# EAGLE design Terminada_v2.1 (EAGLE 6.1)
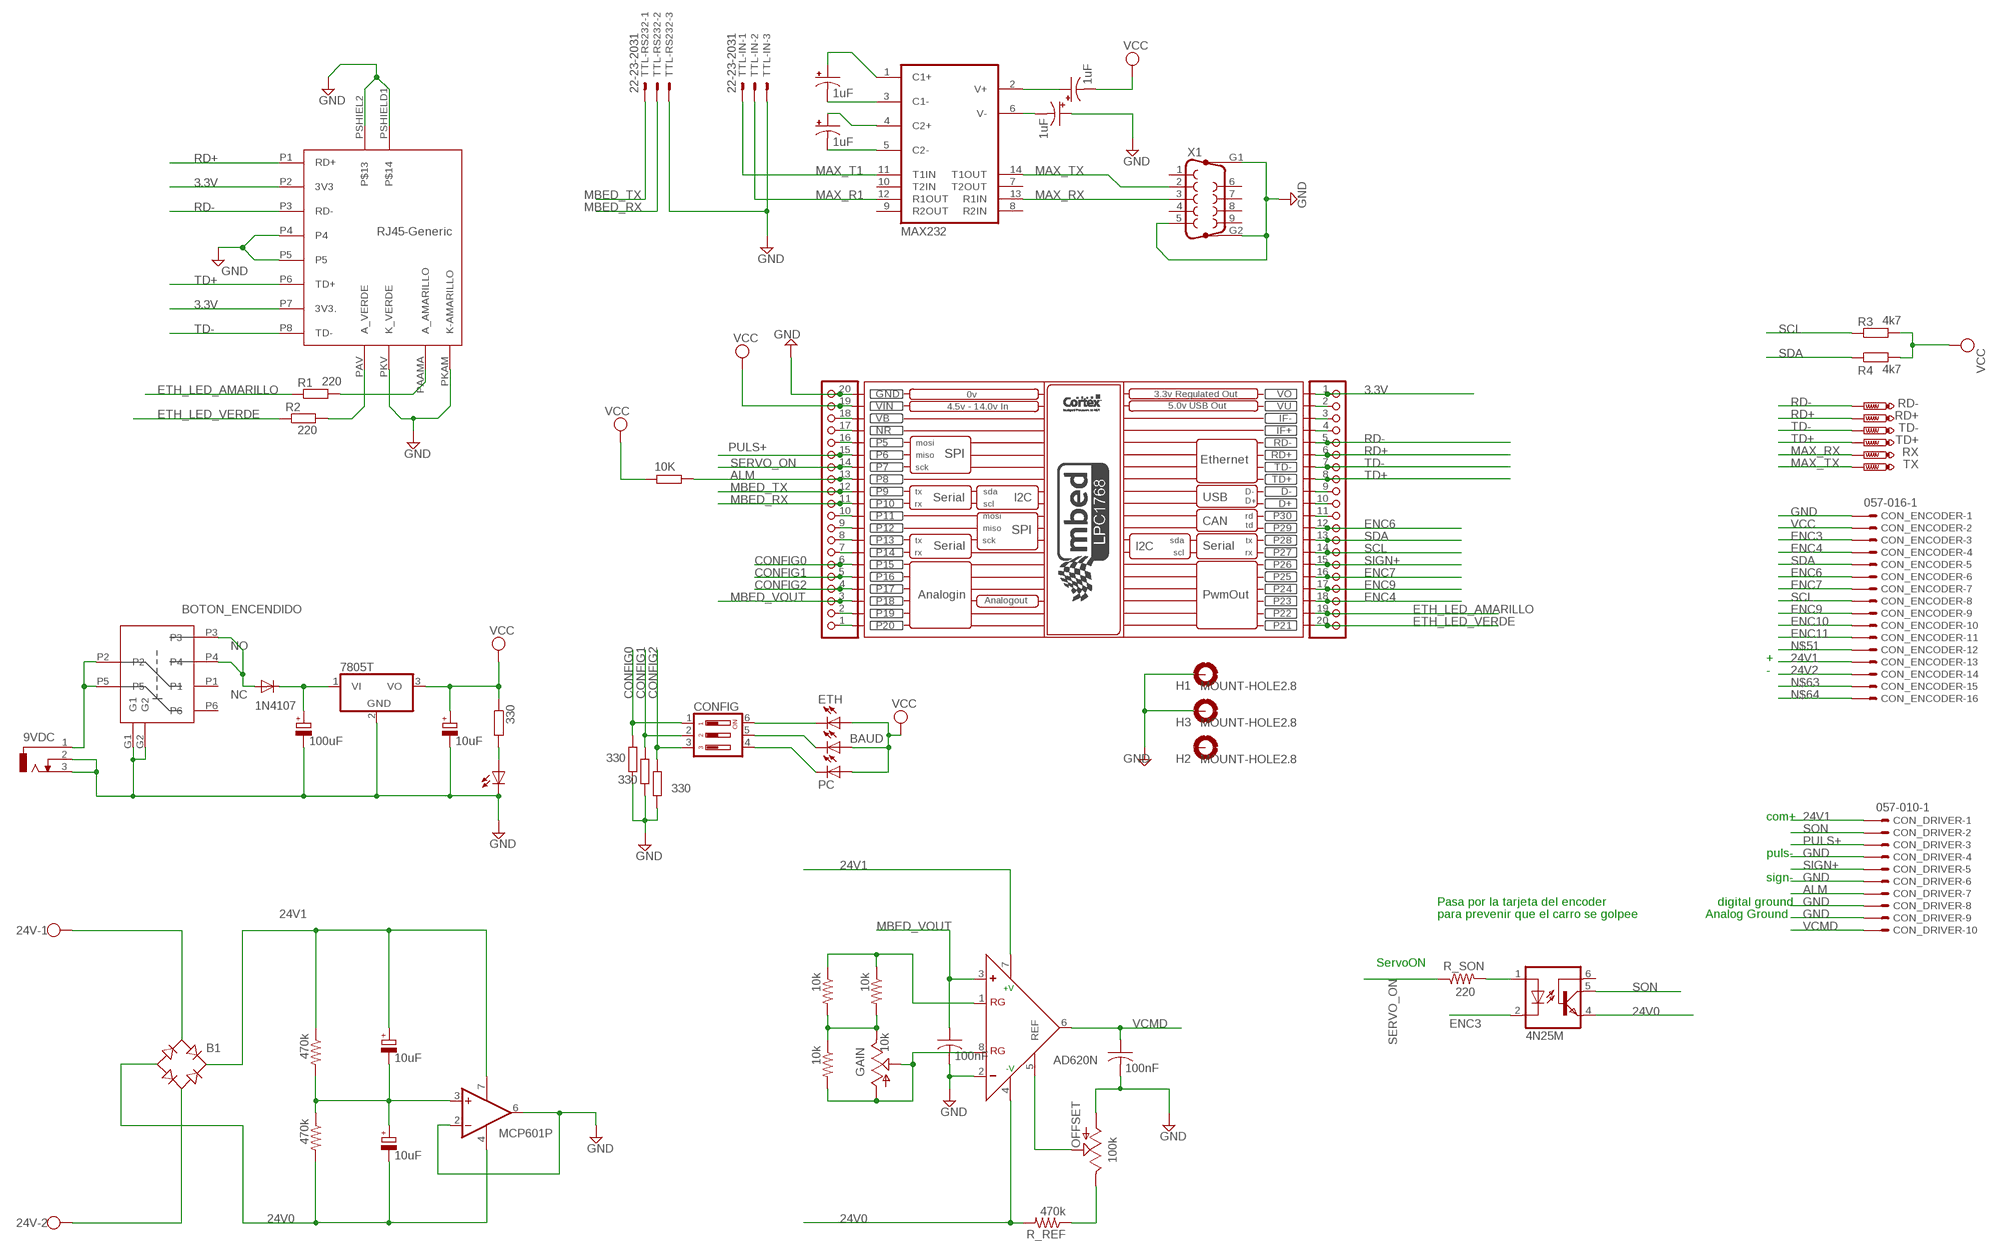
[diagram p0: schematic, sheet 1]

## Parts
9VDC  DCJ0303  [DCJ0303]
24V  W237-02P  [W237-132]
B1  RB1A  [RB1A]
BAUD  LED3MM  [LED3MM]
C1_9V  100uF  CPOL-EUTT5D7  [TT5D7]
C1_+24  10uF  CPOL-EUTT5D7  [TT5D7]
C1_MAX  1uF  CPOL-USE2,5-6E  [E2,5-6E]
C2_0V  10uF  CPOL-EUTT5D7  [TT5D7]
C2_9V  10uF  CPOL-EUTT5D7  [TT5D7]
C2_MAX  1uF  CPOL-USE2,5-6E  [E2,5-6E]
C3_AOUT  100nF  C-US025-024X044  [C025-024X044]
C3_MAX  1uF  CPOL-USE2,5-6E  [E2,5-6E]
C4_MAX  1uF  CPOL-USE2,5-6E  [E2,5-6E]
C5_AOUT  100nF  C-US025-024X044  [C025-024X044]
CON_DRIVER  057-010-1  [057-010-1]
CON_ENCODER  057-016-1  [057-016-1]
CONFIG  DIP03YL  [DIP03YL]
D1_INPUT  1N4107  1N4148DO35-10  [DO35-10]
ETH  LED3MM  [LED3MM]
GAIN  10k  TRIM_US-RJ9W  [RJ9W]
H1  MOUNT-HOLE2.8  MOUNT-PAD-ROUND3.3  [3,3-PAD]
H2  MOUNT-HOLE2.8  MOUNT-PAD-ROUND3.3  [3,3-PAD]
H3  MOUNT-HOLE2.8  MOUNT-PAD-ROUND3.3  [3,3-PAD]
IC1  MAX232  [DIL16]
IC2  7805T  [TO220H]
IC3  MCP601P  [DIL08]
IC4  AD620N  [DIL08]
JP_LEFT  PINHD-1X20  [1X20]
JP_RIGHT  PINHD-1X20  [1X20]
KIT1  MBED_NXP_LPC1768  [MBED-KIT]
OFFSET  100k  TRIM_US-RJ9W  [RJ9W]
OK1  4N25M  [DIL06]
ON/OFF  BOTON_ENCENDIDO  [BOTON_ENCNEDIDO]
PC  LED3MM  [LED3MM]
POWER  LED3MM  [LED3MM]
PWR_LED_R  330  R-EU_0204/7  [0204/7]
R1  220  R-EU_0207/15  [0207/15]
R1_DIV  470k  R-US_0207/10  [0207/10]
R1_G  10k  R-US_0204/7  [0204/7]
R2  220  R-EU_0207/15  [0207/15]
R2_DIV  470k  R-US_0207/10  [0207/10]
R2_G  10k  R-US_0204/7  [0204/7]
R3  4k7  R-EU_0204/7  [0204/7]
R3_G  10k  R-US_0204/7  [0204/7]
R4  4k7  R-EU_0204/7  [0204/7]
R13  330  R-EU_0204/7  [0204/7]
R14  330  R-EU_0204/7  [0204/7]
R15  330  R-EU_0204/7  [0204/7]
R16_ALM  10K  R-EU_0207/12  [0207/12]
R_REF  470k  R-US_0204/7  [0204/7]
R_SON  220  R-US_0207/7  [0207/7]
RD+  PTR1PAD1-13Y  [P1-13Y]
RD-  PTR1PAD1-13Y  [P1-13Y]
RX  PTR1PAD1-13Y  [P1-13Y]
TD+  PTR1PAD1-13Y  [P1-13Y]
TD-  PTR1PAD1-13Y  [P1-13Y]
TTL-IN  22-23-2031  [22-23-2031]
TTL-RS232  22-23-2031  [22-23-2031]
TX  PTR1PAD1-13Y  [P1-13Y]
U$1  RJ-45-GENERIC  [RJ45-GENERIC]
X1  F09HP  [F09HP]

## Nets
3.3V: JP_RIGHT.1 KIT1.VOUT(VO) U$1.P2(3V3) U$1.P7(3V3.)
24V0: B1.- C2_0V.- IC3.4(V-) IC4.4(-V) OK1.4(EMI) R2_DIV.2 R_REF.2
24V1: B1.+ C1_+24.+ CON_DRIVER.1 CON_ENCODER.13 IC3.7(V+) IC4.7(+V) R1_DIV.1
24V2: CON_ENCODER.14
ALM: CON_DRIVER.7 JP_LEFT.13 KIT1.P$8(P8) R16_ALM.1
CONFIG0: CONFIG.1 JP_LEFT.6 KIT1.P$15(P15) R15.2
CONFIG1: CONFIG.2 JP_LEFT.5 KIT1.P$16(P16) R14.2
CONFIG2: CONFIG.3 JP_LEFT.4 KIT1.P$17(P17) R13.2
ENC3: CON_ENCODER.3 OK1.2(C)
ENC4: CON_ENCODER.4 JP_RIGHT.18 KIT1.P$23(P23)
ENC6: CON_ENCODER.6 JP_RIGHT.12 KIT1.P$29(P29)
ENC7: CON_ENCODER.7 JP_RIGHT.16 KIT1.P$25(P25)
ENC9: CON_ENCODER.9 JP_RIGHT.17 KIT1.P$24(P24)
ENC10: CON_ENCODER.10
ENC11: CON_ENCODER.11
ETH_LED_AMARILLO: JP_RIGHT.19 KIT1.P$22(P22) R1.1
ETH_LED_VERDE: JP_RIGHT.20 KIT1.P$21(P21) R2.1
GND: 9VDC.2 9VDC.3 C1_9V.- C2_9V.- C3_AOUT.2 C3_MAX.+ C5_AOUT.2 CON_DRIVER.4 CON_DRIVER.6 CON_DRIVER.8 CON_DRIVER.9 CON_ENCODER.1 H1.B3,3(MOUNT) H3.B3,3(MOUNT) IC2.2(GND) IC3.2(-IN) IC3.6(OUT) IC4.2(-) JP_LEFT.20 KIT1.GND OFFSET.A ON/OFF.G1 ON/OFF.G2 POWER.K(C) R13.1 R14.1 R15.1 TTL-IN.3 TTL-RS232.3 U$1.P4 U$1.P5 U$1.PKAM(K-AMARILLO) U$1.PKV(K_VERDE) U$1.PSHIEL2 U$1.PSHIELD1 X1.5 X1.G1 X1.G2
MAX_R1: IC1.12(R1OUT) TTL-IN.2
MAX_RX: IC1.13(R1IN) RX.TP X1.3
MAX_T1: IC1.11(T1IN) TTL-IN.1
MAX_TX: IC1.14(T1OUT) TX.TP X1.2
MBED_RX: JP_LEFT.11 KIT1.P$10(P10) TTL-RS232.2
MBED_TX: JP_LEFT.12 KIT1.P$9(P9) TTL-RS232.1
MBED_VOUT: C5_AOUT.1 IC4.3(+) JP_LEFT.3 KIT1.P$18(P18)
N$1: 24V.1 B1.AC1
N$2: 24V.2 B1.AC2
N$3: C1_+24.- C2_0V.+ IC3.3(+IN) R1_DIV.2 R2_DIV.1
N$5: JP_RIGHT.2 KIT1.VU
N$7: JP_RIGHT.3 KIT1.IF-
N$8: OFFSET.E R_REF.1
N$9: IC4.1(RG) R1_G.1 R3_G.1
N$10: GAIN.E R1_G.2 R2_G.1 R3_G.2
N$11: GAIN.A GAIN.S IC4.8(RG) R2_G.2
N$12: D1_INPUT.A ON/OFF.P3 ON/OFF.P4
N$14: JP_RIGHT.4 KIT1.IF+
N$15: IC4.5(REF) OFFSET.S
N$16: JP_RIGHT.11 KIT1.P$30(P30)
N$18: 9VDC.1 ON/OFF.P2 ON/OFF.P5
N$20: OK1.1(A) R_SON.2
N$21: C1_9V.+ D1_INPUT.C IC2.1(VI)
N$24: CONFIG.6 ETH.K(C)
N$25: BAUD.K(C) CONFIG.5
N$26: CONFIG.4 PC.K(C)
N$31: JP_RIGHT.9 KIT1.D-
N$32: JP_RIGHT.10 KIT1.D+
N$33: C1_MAX.+ IC1.1(C1+)
N$34: C1_MAX.- IC1.3(C1-)
N$35: C2_MAX.- IC1.5(C2-)
N$36: C2_MAX.+ IC1.4(C2+)
N$37: C4_MAX.+ IC1.2(V+)
N$38: C3_MAX.- IC1.6(V-)
N$46: R1.2 U$1.PAAMA(A_AMARILLO)
N$48: JP_LEFT.18 KIT1.VB
N$49: JP_LEFT.17 KIT1.NR
N$50: JP_LEFT.16 KIT1.P$5(P5)
N$51: CON_ENCODER.12
N$52: R2.2 U$1.PAV(A_VERDE)
N$53: JP_LEFT.10 KIT1.P$11(P11)
N$54: JP_LEFT.9 KIT1.P$12(P12)
N$55: JP_LEFT.8 KIT1.P$13(P13)
N$57: JP_LEFT.7 KIT1.P$14(P14)
N$59: JP_LEFT.2 KIT1.P$19(P19)
N$60: JP_LEFT.1 KIT1.P$20(P20)
N$61: POWER.A PWR_LED_R.2
N$63: CON_ENCODER.15
N$64: CON_ENCODER.16
PULS+: CON_DRIVER.3 JP_LEFT.15 KIT1.P$6(P6)
RD+: JP_RIGHT.6 KIT1.RD+ RD+.TP U$1.P1(RD+)
RD-: JP_RIGHT.5 KIT1.RD- RD-.TP U$1.P3(RD-)
SCL: CON_ENCODER.8 JP_RIGHT.14 KIT1.P$27(P27) R3.1
SDA: CON_ENCODER.5 JP_RIGHT.13 KIT1.P$28(P28) R4.1
SERVO_ON: JP_LEFT.14 KIT1.P$7(P7) R_SON.1
SIGN+: CON_DRIVER.5 JP_RIGHT.15 KIT1.P$26(P26)
SON: CON_DRIVER.2 OK1.5(COL)
TD+: JP_RIGHT.8 KIT1.TD+ TD+.TP U$1.P6(TD+)
TD-: JP_RIGHT.7 KIT1.TD- TD-.TP U$1.P8(TD-)
VCC: BAUD.A C2_9V.+ C4_MAX.- CON_ENCODER.2 ETH.A IC2.3(VO) JP_LEFT.19 KIT1.VIN PC.A PWR_LED_R.1 R3.2 R4.2 R16_ALM.2
VCMD: C3_AOUT.1 CON_DRIVER.10 IC4.6(OUT)
Unconnected: H2.B3,3(MOUNT) IC1.7(T2OUT) IC1.8(R2IN) IC1.9(R2OUT) IC1.10(T2IN) OK1.6(BAS) ON/OFF.P1 ON/OFF.P6 X1.1 X1.4 X1.6 X1.7 X1.8 X1.9

## Notes on the sheet
- +
- -
- com+
- puls-
- sign-
- Pasa por la tarjeta del encoder | digital ground
- para prevenir que el carro se golpee | Analog Ground
- ServoON

## Power pins joined to a net without a drawn wire
GND: IC1.15(GND)
VCC: IC1.16(VCC)

## Library data of the parts
9VDC = con-jack:DCJ0303: DC POWER JACK Source: DCJ0303.pdf
24V = con-wago-508:W237-02P: WAGO SREW CLAMP
B1 = rectifier:RB1A: RECTIFIER 1 A
BAUD ETH PC POWER = led:LED: LED OSRAM: - CHIPLED LG R971, LG N971, LY N971, LG Q971, LY Q971, LO R971, LY R971 LH N974, LH R974 LS Q976, LO Q976, LY Q976 LO Q996 - Hyper CHIPLED LW Q18S LB Q993, LB Q99A, LB R99A - SideLED LS A670, LO A670, LY A670, LG A670, LP A670 LB A673, LV A673, LT A673, LW A673 LH A674 LY A675 LS A676, LA A676, LO A676, LY A676, LW A676 LS A679, LY A679, LG A679 - Hyper Micro SIDELED® LS Y876, LA Y876, LO Y876, LY Y876 LT Y87S - SmartLED LW L88C, LW L88S LB L89C, LB L89S, LG L890 LS L89K, LO L89K, LY L89K LS L896, LA L896, LO L896, LY L896 - TOPLED LS T670, LO T670, LY T670, LG T670, LP T670 LSG T670, LSP T670, LSY T670, LOP T670, LYG T670 LG T671, LOG T671, LSG T671 LB T673, LV T673, LT T673, LW T673 LH T674 LS T676, LA T676, LO T676, LY T676, LB T676, LH T676, LSB T676, LW T676 LB T67C, LV T67C, LT T67C, LS T67K, LO T67K, LY T67K, LW E67C LS E67B, LA E67B, LO E67B, LY E67B, LB E67C, LV E67C, LT E67C LW T67C LS T679, LY T679, LG T679 LS T770, LO T770, LY T770, LG T770, LP T770 LB T773, LV T773, LT T773, LW T773 LH T774 LS E675, LA E675, LY E675, LS T675 LS T776, LA T776, LO T776, LY T776, LB T776 LHGB T686 LT T68C, LB T68C - Hyper Mini TOPLED® LB M676 - Mini TOPLED Santana® LG M470 LS M47K, LO M47K, LY M47K Source: http://www.osram.convergy.de LUXEON: - LUMILED® LXK2-PW12-R00, LXK2-PW12-S00, LXK2-PW14-U00, LXK2-PW14-V00 LXK2-PM12-R00, LXK2-PM12-S00, LXK2-PM14-U00 LXK2-PE12-Q00, LXK2-PE12-R00, LXK2-PE12-S00, LXK2-PE14-T00, LXK2-PE14-U00 LXK2-PB12-K00, LXK2-PB12-L00, LXK2-PB12-M00, LXK2-PB14-N00, LXK2-PB14-P00, LXK2-PB14-Q00 LXK2-PR12-L00, LXK2-PR12-M00, LXK2-PR14-Q00, LXK2-PR14-R00 LXK2-PD12-Q00, LXK2-PD12-R00, LXK2-PD12-S00 LXK2-PH12-R00, LXK2-PH12-S00 LXK2-PL12-P00, LXK2-PL12-Q00, LXK2-PL12-R00 Source: www.luxeon.com KINGBRIGHT: KA-3528ASYC Source: www.kingbright.com
C1_9V C1_+24 C2_0V C2_9V = rcl:CPOL-EU: POLARIZED CAPACITOR, European symbol
C1_MAX C2_MAX C3_MAX C4_MAX = rcl:CPOL-US: POLARIZED CAPACITOR, American symbol
C3_AOUT C5_AOUT = rcl:C-US: CAPACITOR, American symbol
CON_DRIVER = con-panduit:057-010-: CONNECTOR 10-pin series 057 contact pc board low profile headers; OC_FARNELL: unknown; OC_NEWARK: unknown
CON_ENCODER = con-panduit:057-016-: CONNECTOR 10-pin series 057 contact pc board low profile headers; OC_FARNELL: unknown; OC_NEWARK: unknown
CONFIG = switch-dil:DIP03YL: DIL/CODE SWITCH
D1_INPUT = diode:1N4148: DIODE high speed (Philips)
GAIN OFFSET = pot:TRIM_US-: POTENTIOMETER
H1-H3 = holes:MOUNT-PAD-ROUND: MOUNTING PAD, round
IC1 = maxim:MAX232: RS232 TRANSEIVER
IC2 = linear:78*: Positive VOLTAGE REGULATOR Source: http://cache.national.com/ds/LM/LM78L05.pdf http://www.fairchildsemi.com/ds/LM/LM7805.pdf
IC3 = linear:MCP601: Single Op Amp 2.7V to 6.0V Single Supply CMOS Source: http://ww1.microchip.com/downloads/en/DeviceDoc/21314g.pdf
IC4 = analog-devices:AD620: Low Cost, Low Power, Instrumentation Amplifier Source: http://www.analog.com/UploadedFiles/Data_Sheets/37793330023930AD620_e.pdf
JP_LEFT JP_RIGHT = pinhead:PINHD-1X20: PIN HEADER
KIT1 = MBED_v2.1:MBED_NXP_LPC1768: Mbed LPC1768 - ARM CORTEX v2.1 * Schematic symbol is now placed in eagles's default raster. *The pads diameter are suitable for routing between mbed pins * mbed pads are 0.8 mm drill diameter. --------------------------------------------- Created by: Mohamed Yousry *Alexandria, Egypt *Email: mohamed.yousry@ieeegoldegypt.org
OK1 = optocoupler:4N*?M: General Purpose 6-Pin Phototransistor Optocouplers Source: http://www.fairchildsemi.com/ds/4N/4N35-M.pdf
ON/OFF = Boton_Encendido:BOTON_ENCENDIDO
PWR_LED_R R1-R4 R13-R15 R16_ALM = rcl:R-EU_: RESISTOR, European symbol
R1_DIV R1_G R2_DIV R2_G R3_G R_REF = resistor:R-US_: RESISTOR, American symbol
R_SON = rcl:R-US_: RESISTOR, American symbol
RD+ RD- RX TD+ TD- TX = testpad:PTR1: TEST PIN
TTL-IN TTL-RS232 = con-molex:22-23-2031: .100" (2.54mm) Center Header - 3 Pin; MF: MOLEX; MPN: 22-23-2031; OC_FARNELL: 1462950; OC_NEWARK: 30C0862
U$1 = RJ45:RJ-45-GENERIC
X1 = con-subd:F09HP: SUB-D

## Board
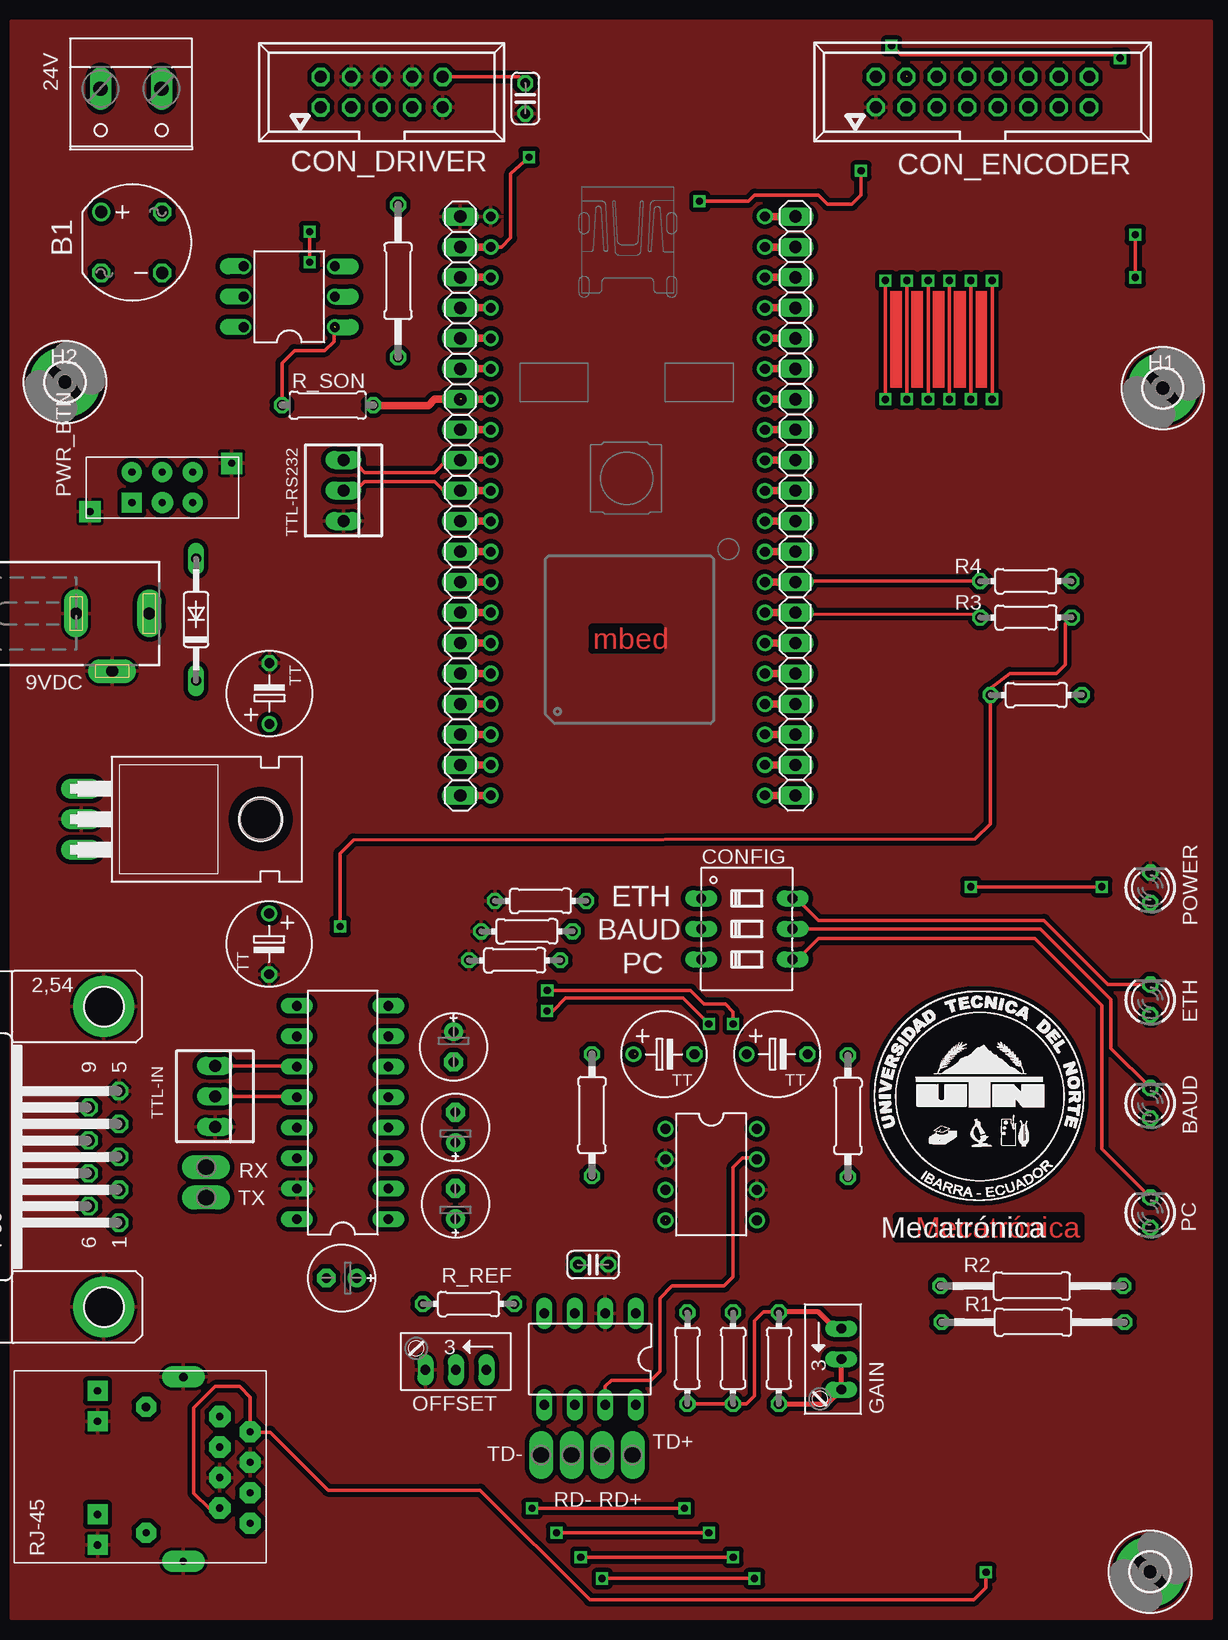
[diagram p1: board, top side]
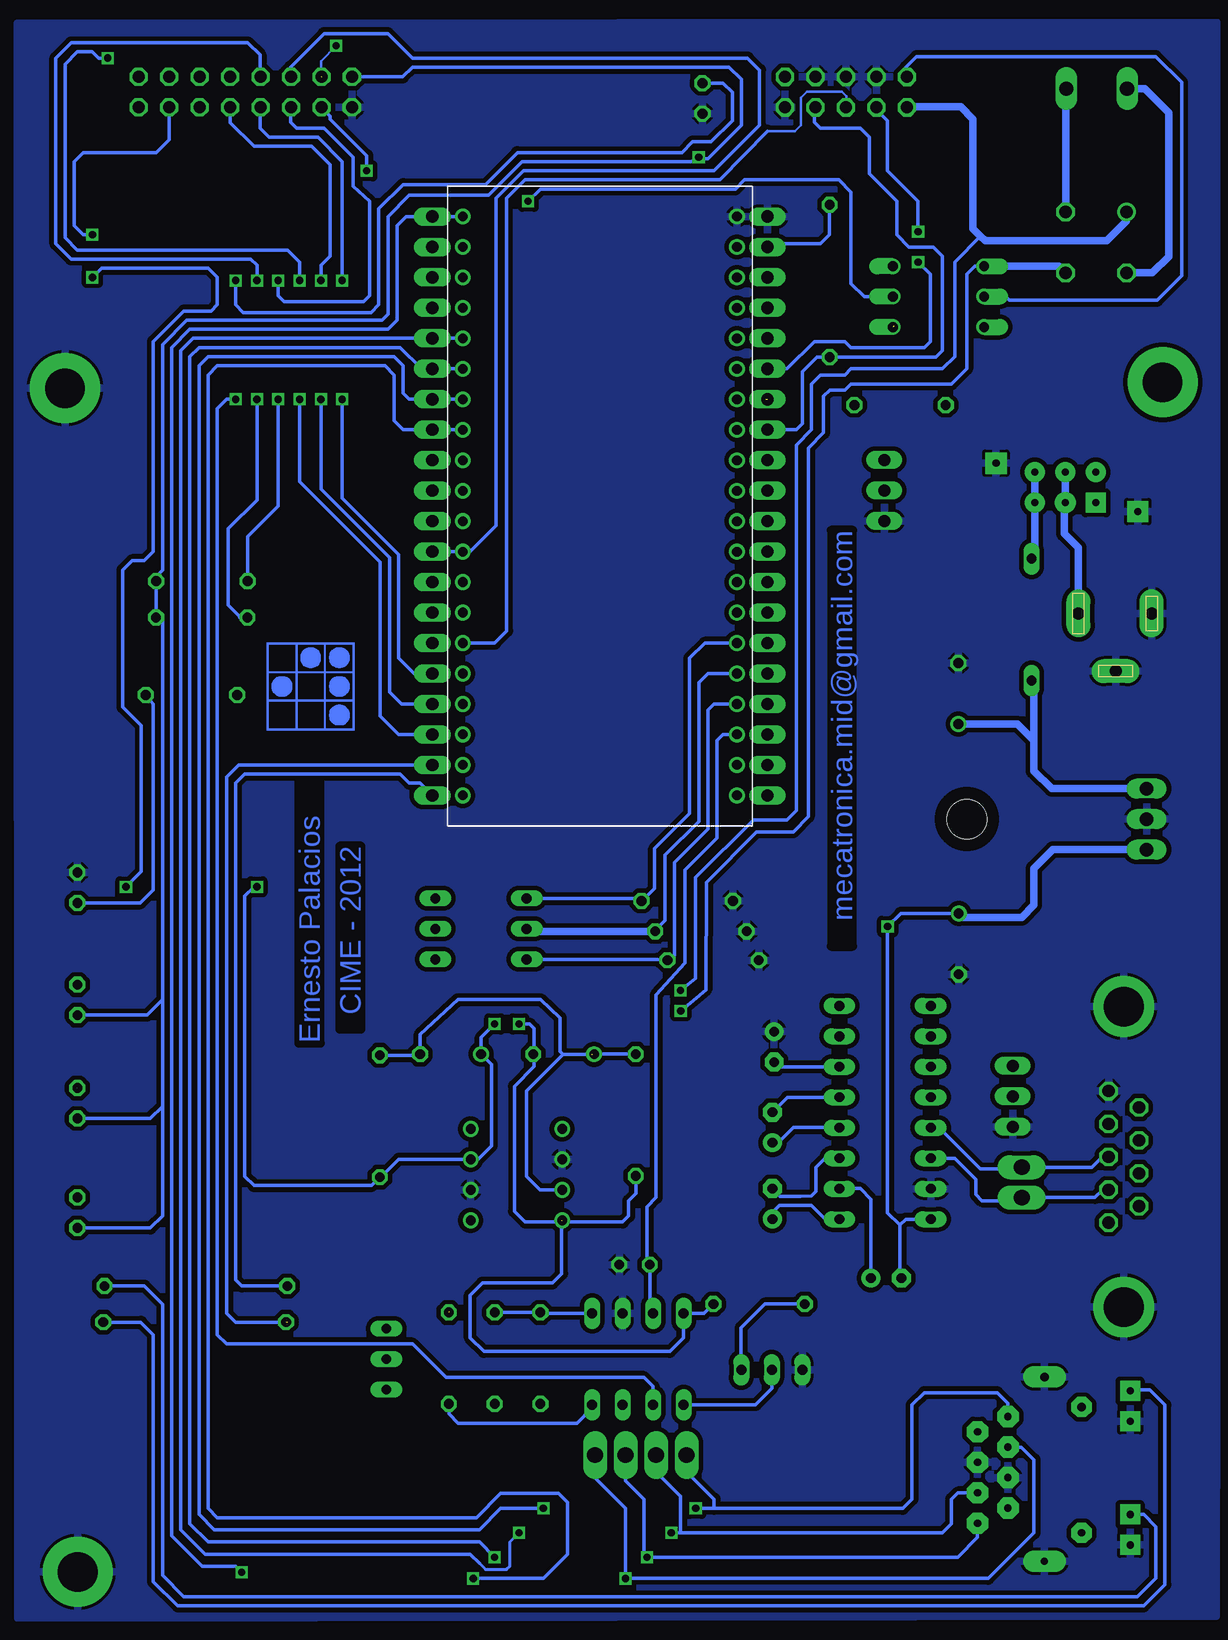
[diagram p2: board, bottom side, seen from below]

No outline drawn. Coordinates in mm, seen from the top.
Copper layers (1*16): Top 0.035mm / dielectric 1.5mm / Bottom 0.035mm
Design rules: minimum track width 10mil, minimum drill 24mil, track to track 15mil, track to pad 15mil, pad to pad 15mil, via to via 15mil, smd to smd 15mil, copper to edge 40mil, drill to drill 8mil, minimum pad ring 10mil, minimum via ring 8mil, stop-mask expansion 4mil, vias tented up to drill 0mil, thermal gap 10mil

### Footprints (pad centres in the part's own frame; a part is rotated, then mirrored left to right if it is on the bottom)
DCJ0303 = drill 1 pad 2 long: 1 0,3.1; 2 4.8,0; 3 0,-3
W237-132 = drill 1.194 long: 1 -2.54,-0.635; 2 2.54,-0.635
RB1A = drill 1.016: + -2.54,2.54 | drill 1.016 octagon: - 2.54,-2.54; AC1 2.54,2.54; AC2 -2.54,-2.54
LED3MM = drill 0.813 octagon: A -1.27,0; K 1.27,0
TT5D7 = drill 0.813: + -2.54,0 | drill 0.813 octagon: - 2.54,0
E2,5-6E = drill 0.813 pad 1.575: + -1.27,0 | drill 0.813 pad 1.575 octagon: - 1.27,0
C025-024X044 = drill 0.813 octagon: 1 -1.27,0; 2 1.27,0
057-010-1 = drill 1 octagon: 1 -5.08,-1.27; 2 -5.08,1.27; 3 -2.54,-1.27; 4 -2.54,1.27; 5 0,-1.27; 6 0,1.27; 7 2.54,-1.27; 8 2.54,1.27; 9 5.08,-1.27; 10 5.08,1.27
057-016-1 = drill 1 octagon: 1 -8.89,-1.27; 2 -8.89,1.27; 3 -6.35,-1.27; 4 -6.35,1.27; 5 -3.81,-1.27; 6 -3.81,1.27; 7 -1.27,-1.27; 8 -1.27,1.27; 9 1.27,-1.27; 10 1.27,1.27; 11 3.81,-1.27; 12 3.81,1.27; 13 6.35,-1.27; 14 6.35,1.27; 15 8.89,-1.27; 16 8.89,1.27
DIP03YL = drill 0.813 long: 1 -2.54,-3.81; 2 0,-3.81; 3 2.54,-3.81; 4 2.54,3.81; 5 0,3.81; 6 -2.54,3.81
DO35-10 = drill 0.813 long: A 5.08,0; C -5.08,0
RJ9W = drill 0.813 long: A 2.54,0.635; E -2.54,0.635; S 0,0.635
3,3-PAD = drill 3.3 pad 5.842: B3,3 0,0
DIL16 = drill 0.813 long: 1 -8.89,-3.81; 2 -6.35,-3.81; 3 -3.81,-3.81; 4 -1.27,-3.81; 5 1.27,-3.81; 6 3.81,-3.81; 7 6.35,-3.81; 8 8.89,-3.81; 9 8.89,3.81; 10 6.35,3.81; 11 3.81,3.81; 12 1.27,3.81; 13 -1.27,3.81; 14 -3.81,3.81; 15 -6.35,3.81; 16 -8.89,3.81
TO220H = drill 1.118 long: 1 -2.54,-10.16; 2 0,-10.16; 3 2.54,-10.16 | hole 3.302: 0,4.826
DIL08 = drill 0.813 pad 1.27: 1 -3.81,-3.81; 2 -1.27,-3.81; 3 1.27,-3.81; 4 3.81,-3.81; 5 3.81,3.81; 6 1.27,3.81; 7 -1.27,3.81; 8 -3.81,3.81
DIL08' = drill 0.813 long: 1 -3.81,-3.81; 2 -1.27,-3.81; 3 1.27,-3.81; 4 3.81,-3.81; 5 3.81,3.81; 6 1.27,3.81; 7 -1.27,3.81; 8 -3.81,3.81
1X20 = drill 1.016 long: 1 -24.13,0; 2 -21.59,0; 3 -19.05,0; 4 -16.51,0; 5 -13.97,0; 6 -11.43,0; 7 -8.89,0; 8 -6.35,0; 9 -3.81,0; 10 -1.27,0; 11 1.27,0; 12 3.81,0; 13 6.35,0; 14 8.89,0; 15 11.43,0; 16 13.97,0; 17 16.51,0; 18 19.05,0; 19 21.59,0; 20 24.13,0
MBED-KIT = drill 0.8: D+ 11.43,1.27; D- 11.43,3.81; GND -11.43,24.13; IF+ 11.43,16.51; IF- 11.43,19.05; NR -11.43,16.51; P$5 -11.43,13.97; P$6 -11.43,11.43; P$7 -11.43,8.89; P$8 -11.43,6.35; P$9 -11.43,3.81; P$10 -11.43,1.27; P$11 -11.43,-1.27; P$12 -11.43,-3.81; P$13 -11.43,-6.35; P$14 -11.43,-8.89; P$15 -11.43,-11.43; P$16 -11.43,-13.97; P$17 -11.43,-16.51; P$18 -11.43,-19.05; P$19 -11.43,-21.59; P$20 -11.43,-24.13; P$21 11.43,-24.13; P$22 11.43,-21.59; P$23 11.43,-19.05; P$24 11.43,-16.51; P$25 11.43,-13.97; P$26 11.43,-11.43; P$27 11.43,-8.89; P$28 11.43,-6.35; P$29 11.43,-3.81; P$30 11.43,-1.27; RD+ 11.43,11.43; RD- 11.43,13.97; TD+ 11.43,6.35; TD- 11.43,8.89; VB -11.43,19.05; VIN -11.43,21.59; VOUT 11.43,24.13; VU 11.43,21.59
DIL06 = drill 0.813 offset: 1 -2.54,-3.81; 2 0,-3.81; 3 2.54,-3.81; 4 2.54,3.81; 5 0,3.81; 6 -2.54,3.81
BOTON_ENCNEDIDO = drill 0.6 pad 1.778 square: G1 -2.019,6.039; G2 2.018,-5.785 | drill 0.6 pad 1.676 square: P1 -1.27,2.54 | drill 0.6 pad 1.778: P2 -1.27,0 | drill 0.6 pad 1.676: P3 -1.27,-2.54; P4 1.27,-2.54; P5 1.27,0; P6 1.27,2.54
0204/7 = drill 0.813 octagon: 1 -3.81,0; 2 3.81,0
0207/15 = drill 0.813 octagon: 1 -7.62,0; 2 7.62,0
0207/10 = drill 0.813 octagon: 1 -5.08,0; 2 5.08,0
0207/12 = drill 0.813 octagon: 1 -6.35,0; 2 6.35,0
0207/7 = drill 0.813 octagon: 1 -3.81,0; 2 3.81,0
P1-13Y = drill 1.321 pad 1.905 long: TP 0,0
22-23-2031 = drill 1 long: 1 -2.54,0; 2 0,0; 3 2.54,0
RJ45-GENERIC = drill 0.6 pad 1.778 octagon: P1 12.2,19.685; P2 10.93,17.145; P3 9.66,19.685; P4 8.39,17.145; P5 7.12,19.685; P6 5.85,17.145; P7 4.58,19.685; P8 3.31,17.145 | drill 0.6 pad 1.676 square: PAAMA 1.17,6.958; PAV 11.465,6.958; PKAM 3.71,6.958; PKV 14.005,6.958 | drill 0.6 pad 1.778 long: PSHIEL2 15.375,14.105 | drill 0.7 pad 1.778 long: PSHIELD1 0,14.105 | drill 0.7 pad 1.676 octagon: PSTAND 2.5,11.008 | drill 0.6 pad 1.676 octagon: PSTAND2 13,11.008
F09HP = drill 1.016 octagon: 1 -5.486,-1.27; 2 -2.743,-1.27; 3 0,-1.27; 4 2.743,-1.27; 5 5.486,-1.27; 6 -4.115,1.27; 7 -1.372,1.27; 8 1.372,1.27; 9 4.115,1.27 | drill 3.302 pad 5.08: G1 -12.522,0; G2 12.522,0

### Placement (x,y rotation side)
9VDC  142.16,99.51 270 top
24V  143.73,142.63 180 top
B1  143.79,130.45 0 top
BAUD  228.71,58.69 90 top
C1_9V  155.27,92.84 90 top
C1_+24  197.6,62.79 0 top
C1_MAX  170.78,50.31 90 top
C2_0V  188.17,62.78 0 top
C2_9V  155.24,71.98 270 top
C2_MAX  170.78,56.68 90 top
C3_AOUT  176.6,142.45 270 top
C3_MAX  170.62,63.39 270 top
C4_MAX  161.29,44.12 180 top
C5_AOUT  182.26,45.24 0 top
CON_DRIVER  164.63,142.97 0 top
CON_ENCODER  214.72,142.98 0 top
CONFIG  195.07,73.22 270 top
D1_INPUT  149.16,99.01 90 top
ETH  228.71,67.31 90 top
GAIN  202.31,37.36 270 top
H1  229.74,118.29 0 top
H2  138.23,118.79 0 top
H3  228.68,19.63 0 top
IC1  161.38,57.92 90 top
IC2  149.72,82.37 270 top
IC3  192.1,52.75 270 top
IC4  AD620N  [DIL08']  181.99,37.36 180 top
JP_LEFT  171.18,108.48 90 top
JP_RIGHT  199.12,108.48 270 top
KIT1  185.15,108.48 0 top
OFFSET  170.81,37.11 180 top
OK1  156.93,125.93 90 top
ON/OFF  146.34,110.03 90 top
PC  228.71,49.57 90 top
POWER  228.71,76.66 90 top
PWR_LED_R  219.2,92.73 0 top
R1  218.93,40.45 0 top
R1_DIV  203.5,57.61 90 top
R1_G  193.92,37.44 270 top
R2  218.83,43.46 0 top
R2_DIV  182.16,57.71 270 top
R2_G  197.75,37.44 270 top
R3  218.34,99.18 0 top
R3_G  190.11,37.44 270 top
R4  218.33,102.21 0 top
R13  175.71,70.61 0 top
R14  176.73,73.02 0 top
R15  177.87,75.56 0 top
R16_ALM  166,127.24 90 top
R_REF  171.88,41.96 0 top
R_SON  160.13,116.89 180 top
RD+  183.01,29.36 180 top
RD-  180.47,29.36 180 top
RX  149.99,53.37 90 top
TD+  185.55,29.36 180 top
TD-  177.93,29.36 180 top
TTL-IN  150.73,59.27 270 top
TTL-RS232  161.44,109.77 270 top
TX  149.99,50.83 90 top
U$1  133.99,35.88 270 top
X1  141.47,54.22 90 top

### Tracks (layer width: path | path; a pad name or v marks a point on that pad's centre or on a via)
3.3V  (via drill 0.6)
  Top 0.305: U$1.P2 151.1,24.92 150.24,24.92 148.97,26.19 148.97,33.3 150.75,35.08 152.78,35.08 153.67,34.19 U$1.P7 153.7,31.27 155.32,31.27 160.15,26.44 172.85,26.44 181.99,17.3 214,17.3 215.01,18.31 v215.01,19.58
  Top 0.61: KIT1.VOUT JP_RIGHT.1
  Bottom 0.305: KIT1.VOUT 201.29,132.61 202.06,131.85 202.06,123.98 202.82,123.22 219.33,123.22 220.85,121.69 220.85,22.63 218.31,20.09 215.52,20.09 v215.01,19.58
24V0  (via drill 0.6)  (1 unrouted)
  Top 0.305: v178.41,66.4 178.92,66.4 179.94,67.46 189.74,67.46 v191.9,65.3
  Bottom 0.305: OK1.4 153.88,128.47 154.56,127.79 154.56,119.91 155.83,118.64 164.21,118.64 164.72,118.14 165.99,118.14 166.5,117.63 166.5,114.58 167.77,113.31 167.77,82.58 169.04,81.31 172.09,81.31 176.28,77.11 176.33,68.14 v178.41,66.4 | v191.9,65.3 191.01,65.3 190.63,64.92 190.63,62.86 C2_0V.- 190.63,62.7 190.63,61.75 192.28,60.1 192.28,49.68 191.39,48.79 188.47,48.79 188.34,48.92 | R2_DIV.2 182.16,51.17 182.75,50.57 182.75,49.3 183.26,48.79 188.15,48.79 IC3.4 188.34,48.89 188.34,44.48 189.1,43.71 194.94,43.71 195.96,42.7 195.96,39.14 194.82,38 179.32,38 178.18,39.14 IC4.4 176.47,41.17 R_REF.2
  Bottom 0.61: OK1.4 146.88,128.47 B1.-
24V1  (via drill 0.6)
  Top 0.305: v193.93,65.3 193.93,66.32 193.29,66.95 191.52,66.95 190.37,68.1 v178.44,68.1 | v227.46,131.09 v227.46,127.53 | v224.66,76.73 v213.74,76.73 | IC4.7 183.26,35.08 183.77,35.59 187.07,35.59 187.83,36.35 187.83,42.44 188.85,43.46 193.17,43.46 193.93,44.22 193.93,53.37 194.69,54.13 195.8,54.13 IC3.7
  Bottom 0.305: v193.93,65.3 195.06,64.17 C1_+24.+ 194.18,61.91 194.18,55.14 195.31,54.02 IC3.7 201.91,54.02 203.45,52.48 R1_DIV.1 204.19,51.84 214,51.84 214.76,52.6 214.76,75.97 214,76.73 v213.74,76.73 | v178.44,68.1 177.16,69.11 177.16,77.5 172.34,82.32 169.54,82.32 168.78,83.08 168.78,113.56 167.51,114.83 167.51,118.64 166.75,119.41 164.72,119.41 164.21,119.91 156.59,119.91 155.57,120.93 155.57,128.8 153.42,130.96 | CON_ENCODER.13 221.06,139 222.12,137.95 228.22,137.95 228.98,137.19 228.98,131.85 228.22,131.09 v227.46,131.09 | v227.46,127.53 226.69,128.29 217.81,128.29 217.04,127.53 217.04,125.25 217.55,124.74 219.84,124.74 222.38,122.2 222.38,104.67 223.14,103.91 224.16,103.91 224.92,103.15 224.92,91.72 223.39,90.19 223.39,78 v224.66,76.73
  Bottom 0.61: B1.+ 141.25,132.21 142.88,130.58 153.03,130.58 153.42,130.96 154.05,131.6 154.05,140.74 155.07,141.76 159.5,141.76 CON_DRIVER.1
ALM
  Top 0.61: KIT1.P$8 JP_LEFT.13
  Bottom 0.305: JP_LEFT.13 168.78,114.83 168.28,115.34 168.28,119.66 167.04,120.89 R16_ALM.1 157.14,120.89 156.59,121.44 156.59,129.31 157.35,130.07 159.38,130.07 160.4,131.09 160.4,133.88 162.69,136.17 162.69,139.22 163.45,139.98 166.75,139.98 167.26,140.49 167.26,141.62 CON_DRIVER.7
CONFIG0
  Top 0.61: KIT1.P$15 JP_LEFT.6
  Bottom 0.305: KIT1.P$15 176.4,97.05 177.67,95.78 177.67,82.83 180.59,79.91 180.59,76.61 181.64,75.56 R15.2 182.12,75.76 CONFIG.1
CONFIG1
  Top 0.61: KIT1.P$16 JP_LEFT.5
  Bottom 0.305: R14.2 180.49,73.15 179.71,73.94 179.71,79.4 176.91,82.19 176.91,93.75 176.15,94.51 KIT1.P$16
  Bottom 0.61: R14.2 191.06,73.02 CONFIG.2
CONFIG2
  Top 0.61: KIT1.P$17 JP_LEFT.4
  Bottom 0.305: KIT1.P$17 175.64,91.97 176.15,91.47 176.15,81.56 178.94,78.77 178.94,71.02 179.35,70.61 R13.2 180.36,70.68 CONFIG.3
ENC3  (via drill 0.6)
  Top 0.305: v191.13,133.88 195.2,133.88 195.71,134.39 201.04,134.39 201.8,133.63 203.84,133.63 204.6,134.39 v204.6,136.42
  Bottom 0.305: OK1.2 163.12,125.93 164.21,127.03 164.21,134.65 165.23,135.66 173.1,135.66 173.86,134.9 190.12,134.9 v191.13,133.88 | v204.6,136.42 204.6,137.69 207.65,140.74 207.65,140.99 CON_ENCODER.3
ENC4  (via drill 0.6)  (1 unrouted)
  Top 0.305: v210.19,117.37 v210.19,127.28 | v226.19,145.82 225.93,146.07 207.9,146.07 v207.14,146.84
  Top 0.61: KIT1.P$23 JP_RIGHT.18
  Bottom 0.203: v207.14,146.84 208.41,145.57 208.41,144.3
  Bottom 0.305: JP_RIGHT.18 201.93,89.43 203.45,90.96 203.45,103.78 210.19,110.52 v210.19,117.37 | v210.19,127.28 210.19,128.8 211.2,129.82 228.73,129.82 229.74,130.84 229.74,145.31 228.73,146.33 227.46,146.33 226.95,145.82 v226.19,145.82
ENC6
  Top 0.61: KIT1.P$29 JP_RIGHT.12
  Bottom 0.305: JP_RIGHT.12 195.96,104.67 193.8,106.83 193.8,134.14 191.52,136.42 175.64,136.42 171.83,140.23 171.83,144.81 172.85,145.82 200.79,145.82 202.82,147.85 208.15,147.85 210.95,145.06 210.95,144.29 CON_ENCODER.6
ENC7  (via drill 0.6)
  Top 0.305: v206.63,117.37 v206.63,127.28
  Top 0.61: KIT1.P$25 JP_RIGHT.16
  Bottom 0.305: JP_RIGHT.16 200.66,94.51 201.93,95.78 201.93,104.42 206.63,109.12 v206.63,117.37 | v206.63,127.28 206.63,137.19 208.66,139.22 212.72,139.22 213.49,139.98 213.49,141.67 CON_ENCODER.7
ENC9  (via drill 0.6)
  Top 0.305: v208.41,117.37 v208.41,127.28
  Top 0.61: KIT1.P$24 JP_RIGHT.17
  Bottom 0.305: JP_RIGHT.17 201.68,91.97 202.69,92.99 202.69,104.17 208.41,109.88 v208.41,117.37 | v208.41,127.28 208.41,128.55 207.65,129.31 207.65,136.93 209.17,138.46 214,138.46 215.99,140.44 CON_ENCODER.9
ETH_LED_AMARILLO  (1 unrouted)
  Top 0.61: KIT1.P$22 JP_RIGHT.19
  Bottom 0.305: JP_RIGHT.19 215.26,86.89 216.28,85.88 216.28,41.17 215.52,40.41 211.2,40.41
ETH_LED_VERDE
  Top 0.61: KIT1.P$21 JP_RIGHT.20
  Bottom 0.305: R2.1 215.01,43.46 215.52,43.97 215.52,85.37 214.76,86.13 201.8,86.13 201.04,85.37 200.14,85.37 JP_RIGHT.20
GND
  pour Bottom: 133.73,37.16 133.73,148.79 233.71,148.72 233.71,148.71 233.69,15.76 133.78,15.91
  pour Top: 133.73,15.77 233.81,15.77 233.81,148.87 133.73,148.87
MAX_R1
  Top 0.305: TTL-IN.2 157.49,59.27 IC1.12
MAX_RX
  Bottom 0.305: IC1.13 156.83,56.65 153.42,53.24 150.11,53.24 | X1.3 143.29,54.22 144.15,53.37 RX.TP
  Bottom 0.61: 150.11,53.24 RX.TP
MAX_T1
  Top 0.305: TTL-IN.1 157.49,61.81 IC1.11
MAX_TX
  Bottom 0.305: IC1.14 155.56,54.11 153.8,52.35 153.8,51.08 153.29,50.57 150.24,50.57 TX.TP 143.89,50.83 143.24,51.48 X1.2
MBED_RX
  Top 0.305: JP_LEFT.11 169.8,109.75 169.04,110.52 163.19,110.52 162.48,109.75 TTL-RS232.2
  Top 0.61: KIT1.P$10 JP_LEFT.11
MBED_TX
  Top 0.305: JP_LEFT.12 170.05,112.29 169.04,111.28 163.19,111.28 162.23,112.29 TTL-RS232.1
  Top 0.61: KIT1.P$9 JP_LEFT.12
MBED_VOUT
  Top 0.61: KIT1.P$18 JP_LEFT.3
  Bottom 0.305: KIT1.P$18 174.88,89.43 175.39,88.92 175.39,80.8 178.05,78.13 178.05,70.38 180.47,67.72 180.47,50.83 181.23,50.06 181.23,45.48 C5_AOUT.1 180.99,41.44 IC4.3
N$1
  Bottom 0.61: B1.AC1 146.33,143.21 24V.1
N$2
  Bottom 0.61: B1.AC2 139.09,127.91 137.73,129.27 137.73,141.27 139.73,143.27 141.18,143.27 24V.2
N$3  (1 unrouted)
  Bottom 0.305: R1_DIV.2 200.1,62.69 C1_+24.- 200.14,64.43 196.98,67.33 190.12,67.33 188.47,65.81 188.47,63.02 188.21,62.76 | 185.8,62.95 C2_0V.+ 185.76,62.79 R2_DIV.1 | IC3.3 190.14,51.48 191.26,52.6 191.26,59.72 188.21,62.76 | 188.21,62.76 185.8,62.76 185.67,62.89
N$5
  Top 0.61: KIT1.VU JP_RIGHT.2
N$7
  Top 0.61: KIT1.IF- JP_RIGHT.3
N$8
  Bottom 0.305: R_REF.1 171.4,41.96 173.38,39.97 173.38,36.5 OFFSET.E
N$9
  Bottom 0.305: IC4.1 190.03,41.17 R3_G.1 R1_G.1
N$10  (1 unrouted)
  Top 0.305: R3_G.2 R1_G.2 195.03,33.63 195.71,34.31 195.71,40.54 196.47,41.3 197.74,41.3
  Top 0.406: GAIN.E 202.44,39.9 201.04,41.3 197.74,41.3
N$11
  Top 0.406: R2_G.2 201.76,33.63 GAIN.A GAIN.S
  Bottom 0.305: IC4.8 185.8,33.3 187.07,32.03 196.98,32.03 197.74,32.79 R2_G.2
N$12
  Bottom 0.61: D1_INPUT.A 148.88,104.36 ON/OFF.P3 ON/OFF.P4
N$14
  Top 0.61: KIT1.IF+ JP_RIGHT.4
N$15
  Bottom 0.305: OFFSET.S 170.81,34.94 172.18,33.57 178.16,33.57 IC4.5
N$16
  Top 0.61: KIT1.P$30 JP_RIGHT.11
N$18
  Bottom 0.61: 9VDC.1 145.26,105.03 146.43,106.2 146.43,108.67 ON/OFF.P2 ON/OFF.P5
N$20  (1 unrouted)
  Top 0.305: R_SON.2 156.32,120.41 157.35,121.44 159.89,121.44 160.66,122.2 160.66,123.47 160.91,123.72
N$21
  Bottom 0.61: IC2.1 147.5,84.91 148.97,86.39 148.97,88.92 | 148.97,88.92 148.97,93.74 D1_INPUT.C | C1_9V.+ 150.35,90.3 148.97,88.92
N$24
  Top 0.305: CONFIG.6 199.22,75.76 201.04,73.94 219.84,73.94 225.17,68.61 228.69,68.61 ETH.K
N$25  (1 unrouted)
  Top 0.305: CONFIG.5 219.54,73.22 225.43,67.33 225.43,63.27 228.73,59.97
N$26
  Top 0.305: CONFIG.4 199.31,70.68 201.04,72.42 219.07,72.42 224.66,66.83 224.66,54.89 PC.K
N$31
  Top 0.61: KIT1.D- JP_RIGHT.9
N$32
  Top 0.61: KIT1.D+ JP_RIGHT.10
N$33
  Bottom 0.305: IC1.1 166.35,49.03 167.51,50.19 170.18,50.19 170.81,49.55 170.77,49.03 C1_MAX.+
N$34
  Bottom 0.305: IC1.3 166.39,54.11 167.13,53.37 167.13,51.33 167.51,50.95 168.42,50.94 170.13,50.94 C1_MAX.-
N$35
  Bottom 0.305: IC1.5 169.53,59.19 C2_MAX.-
N$36
  Bottom 0.305: C2_MAX.+ 170.3,55.41 169.04,56.67 165.2,56.67 IC1.4
N$37
  Bottom 0.305: C4_MAX.+ 162.56,50.7 163.45,51.59 165.17,51.59 IC1.2
N$38
  Bottom 0.305: IC1.6 170.23,61.73 C3_MAX.-
N$46
  Bottom 0.305: R1.2 223.43,40.45 222.38,39.4 222.38,18.82 220.34,16.79 139.83,16.79 138.05,18.57 138.05,33.55 139.32,34.82 140.83,34.82 U$1.PAAMA
N$48
  Top 0.61: KIT1.VB JP_LEFT.18
N$49
  Top 0.61: KIT1.NR JP_LEFT.17
N$50
  Top 0.61: KIT1.P$5 JP_LEFT.16
N$52
  Bottom 0.305: R2.2 223.14,43.46 221.62,41.94 221.62,19.33 219.84,17.55 140.34,17.55 138.81,19.07 138.81,23.39 139.83,24.41 U$1.PAV
N$53
  Top 0.61: KIT1.P$11 JP_LEFT.10
N$54
  Top 0.61: KIT1.P$12 JP_LEFT.9
N$55
  Top 0.61: KIT1.P$13 JP_LEFT.8
N$57
  Top 0.61: KIT1.P$14 JP_LEFT.7
N$59
  Top 0.61: KIT1.P$19 JP_LEFT.2
N$60
  Top 0.61: KIT1.P$20 JP_LEFT.1
N$61
  Bottom 0.305: POWER.A 223.46,75.39 222.38,76.48 222.38,91.97 PWR_LED_R.2
PULS+  (via drill 0.6)
  Top 0.305: v158.62,128.8 v158.62,131.34
  Top 0.61: JP_LEFT.15 KIT1.P$6
  Bottom 0.305: JP_LEFT.15 169.54,119.91 167.26,122.2 164.72,122.2 164.21,121.69 158.12,121.69 157.61,122.2 157.61,127.79 v158.62,128.8 | v158.62,131.34 158.62,133.88 161.16,136.42 161.16,140.6 162.18,141.62 CON_DRIVER.3
RD+  (via drill 0.6)
  Top 0.305: v181.23,20.85 v193.93,20.85
  Top 0.61: KIT1.RD+ JP_RIGHT.6
  Bottom 0.305: U$1.P1 153.67,22.5 155.32,20.85 v181.23,20.85 181.48,21.11 181.48,25.68 183.01,27.2 RD+.TP | KIT1.RD+ 200.03,119.91 201.8,121.69 218.57,121.69 219.33,120.93 219.33,23.65 217.81,22.12 195.2,22.12 v193.93,20.85
RD-  (via drill 0.6)
  Top 0.305: v179.2,22.89 v191.9,22.89
  Top 0.61: KIT1.RD- JP_RIGHT.5
  Bottom 0.254: 195.2,20.34 194.69,19.84 192.91,19.84 192.66,20.09 192.66,22.12 v191.9,22.89
  Bottom 0.305: U$1.P3 155.29,26.22 155.83,25.68 155.83,23.65 156.59,22.89 178.44,22.89 | 178.44,22.89 v179.2,22.89 | RD-.TP 180.47,27.96 178.44,25.93 178.44,22.89 | KIT1.RD- 219.07,122.45 220.09,121.44 220.09,23.14 218.06,21.11 195.96,21.11 195.2,20.34
SCL  (via drill 0.6)
  Top 0.305: R3.1 214.37,99.18 214.1,99.45 199.28,99.44 JP_RIGHT.14 | v213.74,117.37 v213.74,127.28
  Top 0.61: KIT1.P$27 JP_RIGHT.14
  Bottom 0.305: v213.74,127.28 213.74,128.55 214.25,129.06 229.24,129.06 230.5,130.33 230.5,145.82 229.24,147.09 214.5,147.09 213.49,146.07 213.49,144.29 CON_ENCODER.8 | v213.74,117.37 213.74,108.99 216.15,106.58 216.15,100.23 215.11,99.18
  Bottom 0.406: R3.1 215.11,99.18
SDA  (via drill 0.6)
  Top 0.305: R4.1 199.2,102.21 JP_RIGHT.13 | v211.96,117.37 v211.96,127.28
  Top 0.61: KIT1.P$28 JP_RIGHT.13
  Bottom 0.305: v211.96,127.28 211.96,126.01 211.46,125.5 204.85,125.5 204.34,126.01 204.34,133.88 205.74,135.15 205.74,137.57 208.15,139.98 210.44,139.98 210.95,140.49 210.95,141.67 CON_ENCODER.5 | R4.1 214.52,105.93 211.96,108.48 v211.96,117.37
SERVO_ON  (1 unrouted)
  Top 0.61: R_SON.1 163.96,116.86 168.53,116.86 169.06,117.39 171.3,117.39 171.32,117.37 | KIT1.P$7 JP_LEFT.14
SIGN+
  Top 0.61: KIT1.P$26 JP_RIGHT.15
  Bottom 0.203: 171.2,139.72 168.91,139.72 168.4,140.23 168.4,142.52 167.89,143.03 164.97,143.03 164.59,142.65 164.59,141.74 CON_DRIVER.5
  Bottom 0.305: KIT1.P$26 193.93,97.05 192.91,98.07 192.91,134.14 191.39,135.66 175.13,135.66 171.2,139.72
SON
  Bottom 0.305: OK1.5 151.3,125.93 151,125.63 138.68,125.63 136.65,127.66 136.65,143.79 138.81,145.95 158.75,145.95 159.64,145.06 159.64,144.33 CON_DRIVER.2
TD+  (via drill 0.6)
  Top 0.305: v183.01,19.07 v195.71,19.07
  Top 0.61: KIT1.TD+ JP_RIGHT.8
  Bottom 0.305: U$1.P6 150.02,30.03 148.97,28.98 148.97,22.89 152.78,19.07 v183.01,19.07 183.01,24.92 185.67,27.58 TD+.TP | KIT1.TD+ 201.55,114.83 202.31,115.59 202.31,119.41 203.07,120.17 217.04,120.17 217.81,119.41 217.81,24.92 217.04,24.16 195.45,24.16 193.42,26.19 188.59,26.19 187.83,25.43 187.83,21.11 189.87,19.07 v195.71,19.07
TD-  (via drill 0.6)
  Top 0.305: v177.16,24.92 v189.87,24.92
  Top 0.61: KIT1.TD- JP_RIGHT.7
  Bottom 0.305: U$1.P8 151.13,33.68 152.02,34.57 158.12,34.57 159.13,33.55 159.13,25.68 159.89,24.92 175.64,24.92 | 175.64,24.92 v177.16,24.92 | TD-.TP 177.93,27.96 175.64,25.68 175.64,24.92 | KIT1.TD- 201.04,117.37 201.55,117.88 201.55,120.17 202.31,120.93 217.81,120.93 218.57,120.17 218.57,24.41 217.3,23.14 195.2,23.14 193.42,24.92 v189.87,24.92
VCC  (via drill 0.6)
  Top 0.305: KIT1.VIN 174.62,130.07 175.39,130.84 175.39,136.17 v176.91,137.57 | R3.2 222.38,99.44 221.62,98.67 221.62,95.28 220.85,94.51 216.99,94.51 215.44,93.37 PWR_LED_R.1 215.37,92.64 215.37,81.99 214.1,80.72 162.28,80.64 161.16,79.53 v161.16,73.43
  Top 0.61: KIT1.VIN JP_LEFT.19
  Bottom 0.305: R16_ALM.2 166,131.08 166.75,130.33 170.93,130.33 JP_LEFT.19 | IC1.16 159.66,49.03 160.15,48.54 | 160.15,48.54 160.15,44.24 C4_MAX.- | C2_9V.+ 160.07,74.52 v161.16,73.43 161.16,49.55 160.15,48.54 | 221.62,67.33 221.62,98.83 222.22,99.44 R3.2 222.14,100.56 R4.2 222.09,102.13 222.38,102.39 221.62,103.15 221.62,121.94 219.58,123.98 203.33,123.98 202.82,124.48 202.82,132.61 201.04,134.39 194.44,134.39 191.64,137.19 177.55,137.19 v176.91,137.57 176.53,137.44 176.15,137.44 173.35,140.23 173.35,144.04 174.37,145.06 200.79,145.06 201.59,144.25 CON_ENCODER.2 | 221.62,67.33 221.62,58.45 | 221.62,58.45 221.62,49.3 222.63,48.28 228.69,48.28 PC.A | BAUD.A 222.64,57.42 221.62,58.45 | ETH.A 222.91,66.04 221.62,67.33
  Bottom 0.61: IC2.3 147.4,79.83 148.97,78.26 148.97,75.21 149.99,74.19 154.91,74.19 C2_9V.+
VCMD  (via drill 0.6)
  Top 0.305: v215.52,117.37 v215.52,127.28 | CON_DRIVER.10 176.09,144.24 C3_AOUT.1
  Bottom 0.305: IC4.6 180.72,35.08 181.48,35.84 197.99,35.84 200.79,38.63 216.28,38.63 217.04,39.4 217.04,116.61 216.28,117.37 v215.52,117.37 | v215.52,127.28 215.52,125.25 214.88,124.61 204.22,124.61 203.58,125.25 203.58,133.25 201.55,135.28 194.69,135.28 192.02,137.95 178.31,137.95 177.42,138.84 175.9,138.84 174.12,140.61 174.12,142.97 174.88,143.74 176.59,143.74 C3_AOUT.1
(copper drawn outside any net)
  shapes: Bottom area x943, Top area x9229

### Text on the board
Top: mbed | Mecatrónica
Bottom: mecatronica.mid@gmail.com | CIME - 2012 | Ernesto Palacios
tNames: ETH | BAUD | PC | Mecatrónica